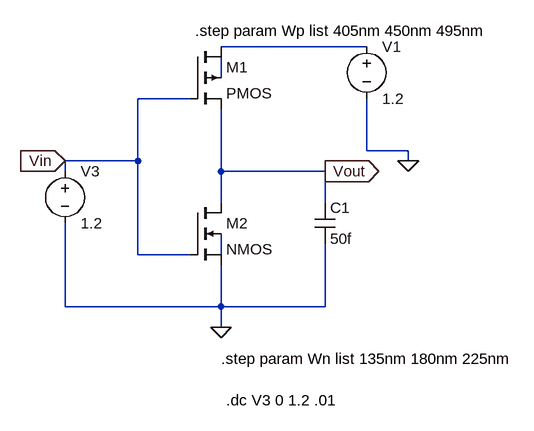
[diagram p0: schematic cmos90nm_vtc_W_variable.asc]
cmos90nm_vtc_W_variable.asc, the LTspice schematic file:
Version 4
SHEET 1 880 680
WIRE 400 32 176 32
WIRE 176 80 176 48
WIRE 128 112 48 112
WIRE 400 192 400 112
WIRE 464 192 400 192
WIRE 48 208 48 112
WIRE 48 208 -64 208
WIRE 464 208 464 192
WIRE -64 224 -64 208
WIRE 176 224 176 128
WIRE 336 224 176 224
WIRE 176 272 176 224
WIRE 336 272 336 224
WIRE 48 352 48 208
WIRE 128 352 48 352
WIRE 176 352 176 320
WIRE -64 432 -64 304
WIRE 176 432 176 368
WIRE 176 432 -64 432
WIRE 336 432 336 336
WIRE 336 432 176 432
WIRE 176 464 176 432
FLAG 176 464 0
FLAG -64 208 Vin
IOPIN -64 208 In
FLAG 336 224 Vout
IOPIN 336 224 Out
FLAG 464 208 0
SYMBOL pmos4 128 32 R0
SYMATTR InstName M1
SYMATTR Value2 l=90nm w=Wp
SYMBOL nmos4 128 272 R0
SYMATTR InstName M2
SYMATTR Value2 l=90nm w=Wn
SYMBOL voltage 400 16 R0
WINDOW 123 0 0 Left 0
WINDOW 39 0 0 Left 0
SYMATTR InstName V1
SYMATTR Value 1.2
SYMBOL voltage -64 208 R0
WINDOW 123 0 0 Left 0
WINDOW 39 0 0 Left 0
SYMATTR InstName V3
SYMATTR Value 1.2
SYMBOL cap 320 272 R0
SYMATTR InstName C1
SYMATTR Value 50f
TEXT 136 8 Left 2 !.step param Wp list 405nm 450nm 495nm
TEXT 176 512 Left 2 !.step param Wn list 135nm 180nm 225nm
TEXT 184 576 Left 2 !.dc V3 0 1.2 .01

The netlist it stands for:
* cmos90nm_vtc_W_variable.asc
M1 N001 Vin Vout N002 PMOS l=90nm w=Wp
M2 Vout Vin 0 N003 NMOS l=90nm w=Wn
V1 N001 0 1.2
V3 Vin 0 1.2
C1 Vout 0 50f
.model NMOS NMOS
.model PMOS PMOS
.lib standard.mos
.step param Wp list 405nm 450nm 495nm
.step param Wn list 135nm 180nm 225nm
.dc V3 0 1.2 .01
.backanno
.end